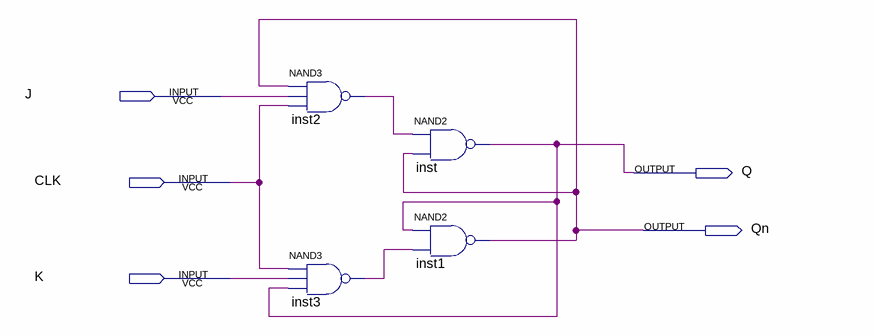
[diagram p0: schematic sheet]
// Quartus schematic flipflop_JK.bdf as structural Verilog: 4 symbols, 5 pins
module flipflop_JK (
  input  J,
  input  CLK,
  input  K,
  output Q,
  output Qn
);

  wire inst2_out, inst3_out;

  nand inst2 (inst2_out, Qn, J, CLK);
  nand inst3 (inst3_out, CLK, K, Q);
  nand inst (Q, inst2_out, Qn);
  nand inst1 (Qn, Q, inst3_out);
endmodule
